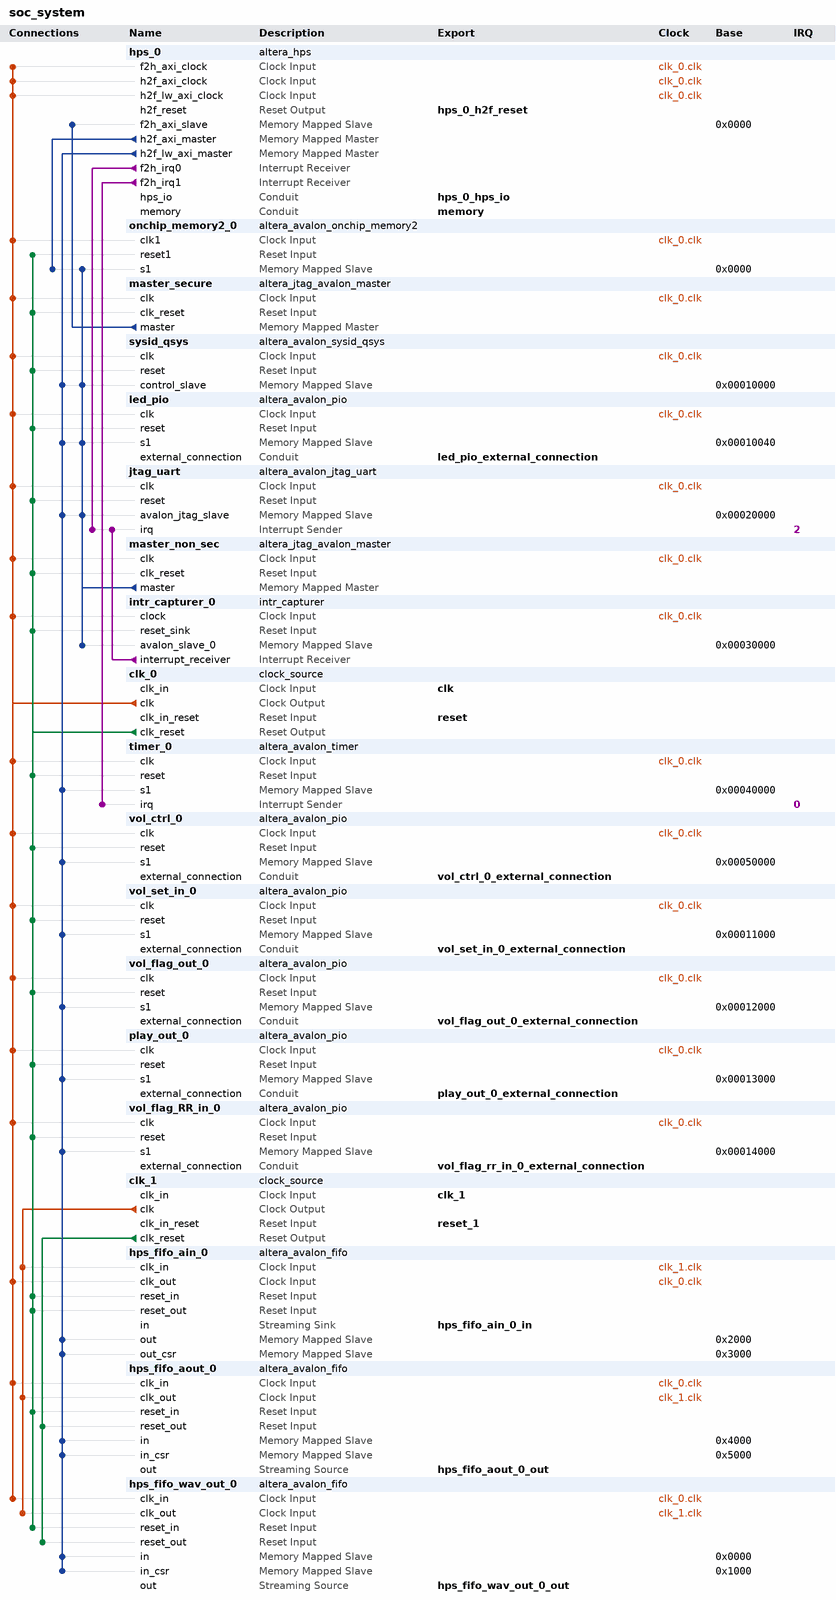
[diagram p0: system contents]
# Platform Designer (Qsys) system soc_system, Cyclone V 5CSEMA5F31C6
# Parameters at their usual value, and those the tool derives, are not listed.
package require -exact qsys 15.1
create_system soc_system
set_project_property DEVICE_FAMILY {Cyclone V}
set_project_property DEVICE 5CSEMA5F31C6

add_instance hps_0 altera_hps 15.1
set_instance_parameter_value hps_0 EMAC1_Mode RGMII
set_instance_parameter_value hps_0 EMAC1_PinMuxing {HPS I/O Set 0}
set_instance_parameter_value hps_0 F2SCLK_COLDRST_Enable false
set_instance_parameter_value hps_0 F2SCLK_DBGRST_Enable false
set_instance_parameter_value hps_0 F2SCLK_WARMRST_Enable false
set_instance_parameter_value hps_0 F2SINTERRUPT_Enable true
set_instance_parameter_value hps_0 F2S_Width 2
set_instance_parameter_value hps_0 FPGA_PERIPHERAL_OUTPUT_CLOCK_FREQ_EMAC0_GTX_CLK 100
set_instance_parameter_value hps_0 FPGA_PERIPHERAL_OUTPUT_CLOCK_FREQ_EMAC0_MD_CLK 100.0
set_instance_parameter_value hps_0 FPGA_PERIPHERAL_OUTPUT_CLOCK_FREQ_EMAC1_GTX_CLK 100
set_instance_parameter_value hps_0 FPGA_PERIPHERAL_OUTPUT_CLOCK_FREQ_EMAC1_MD_CLK 100.0
set_instance_parameter_value hps_0 HPS_PROTOCOL DDR3
set_instance_parameter_value hps_0 I2C0_Mode I2C
set_instance_parameter_value hps_0 I2C0_PinMuxing {HPS I/O Set 0}
set_instance_parameter_value hps_0 I2C1_Mode I2C
set_instance_parameter_value hps_0 I2C1_PinMuxing {HPS I/O Set 0}
set_instance_parameter_value hps_0 LWH2F_Enable true
set_instance_parameter_value hps_0 MEM_BANKADDR_WIDTH 3
set_instance_parameter_value hps_0 MEM_CLK_FREQ 400.0
set_instance_parameter_value hps_0 MEM_COL_ADDR_WIDTH 10
set_instance_parameter_value hps_0 MEM_DQ_WIDTH 32
set_instance_parameter_value hps_0 MEM_DRV_STR RZQ/7
set_instance_parameter_value hps_0 MEM_ROW_ADDR_WIDTH 15
set_instance_parameter_value hps_0 MEM_RTT_NOM RZQ/4
set_instance_parameter_value hps_0 MEM_RTT_WR RZQ/4
set_instance_parameter_value hps_0 MEM_TCL 11
set_instance_parameter_value hps_0 MEM_TFAW_NS 30.0
set_instance_parameter_value hps_0 MEM_TRAS_NS 35.0
set_instance_parameter_value hps_0 MEM_TRCD_NS 13.75
set_instance_parameter_value hps_0 MEM_TRFC_NS 260.0
set_instance_parameter_value hps_0 MEM_TRP_NS 13.75
set_instance_parameter_value hps_0 MEM_VENDOR Micron
set_instance_parameter_value hps_0 MEM_WTCL 8
set_instance_parameter_value hps_0 QSPI_Mode {1 SS}
set_instance_parameter_value hps_0 QSPI_PinMuxing {HPS I/O Set 0}
set_instance_parameter_value hps_0 REF_CLK_FREQ 25.0
set_instance_parameter_value hps_0 S2FCLK_USER2CLK 1
set_instance_parameter_value hps_0 S2F_Width 3
set_instance_parameter_value hps_0 SDIO_Mode {4-bit Data}
set_instance_parameter_value hps_0 SDIO_PinMuxing {HPS I/O Set 0}
set_instance_parameter_value hps_0 SPIM1_Mode {Single Slave Select}
set_instance_parameter_value hps_0 SPIM1_PinMuxing {HPS I/O Set 0}
set_instance_parameter_value hps_0 STM_Enable false
set_instance_parameter_value hps_0 TIMING_BOARD_AC_SKEW 0.02
set_instance_parameter_value hps_0 TIMING_BOARD_AC_TO_CK_SKEW 0.01
set_instance_parameter_value hps_0 TIMING_BOARD_DQ_TO_DQS_SKEW 0.05
set_instance_parameter_value hps_0 TIMING_BOARD_MAX_CK_DELAY 0.03
set_instance_parameter_value hps_0 TIMING_BOARD_MAX_DQS_DELAY 0.02
set_instance_parameter_value hps_0 TIMING_BOARD_SKEW_BETWEEN_DQS 0.06
set_instance_parameter_value hps_0 TIMING_BOARD_SKEW_CKDQS_DIMM_MAX 0.12
set_instance_parameter_value hps_0 TIMING_BOARD_SKEW_CKDQS_DIMM_MIN 0.06
set_instance_parameter_value hps_0 TIMING_BOARD_SKEW_WITHIN_DQS 0.01
set_instance_parameter_value hps_0 TIMING_TDH 65
set_instance_parameter_value hps_0 TIMING_TDQSCK 255
set_instance_parameter_value hps_0 TIMING_TDQSQ 125
set_instance_parameter_value hps_0 TIMING_TDS 30
set_instance_parameter_value hps_0 TIMING_TIH 140
set_instance_parameter_value hps_0 TIMING_TIS 180
set_instance_parameter_value hps_0 TIMING_TQSH 0.4
set_instance_parameter_value hps_0 UART0_Mode {No Flow Control}
set_instance_parameter_value hps_0 UART0_PinMuxing {HPS I/O Set 0}
set_instance_parameter_value hps_0 USB1_Mode SDR
set_instance_parameter_value hps_0 USB1_PinMuxing {HPS I/O Set 0}
set_instance_parameter_value hps_0 desired_cfg_clk_mhz 100.0
set_instance_parameter_value hps_0 desired_qspi_clk_mhz 400.0

add_instance onchip_memory2_0 altera_avalon_onchip_memory2 15.1
set_instance_parameter_value onchip_memory2_0 dataWidth 64
set_instance_parameter_value onchip_memory2_0 dualPort false
set_instance_parameter_value onchip_memory2_0 initMemContent true
set_instance_parameter_value onchip_memory2_0 initializationFileName onchip_memory2_0
set_instance_parameter_value onchip_memory2_0 memorySize 65536

add_instance master_secure altera_jtag_avalon_master 15.1

add_instance sysid_qsys altera_avalon_sysid_qsys 15.1
set_instance_parameter_value sysid_qsys id -1395322110

add_instance led_pio altera_avalon_pio 15.1
set_instance_parameter_value led_pio direction Output
set_instance_parameter_value led_pio resetValue 15
set_instance_parameter_value led_pio width 10

add_instance jtag_uart altera_avalon_jtag_uart 15.1
set_instance_parameter_value jtag_uart allowMultipleConnections true
set_instance_parameter_value jtag_uart simInteractiveOptions INTERACTIVE_ASCII_OUTPUT

add_instance master_non_sec altera_jtag_avalon_master 15.1

add_instance intr_capturer_0 intr_capturer 100.99.98.97

add_instance clk_0 clock_source 15.1
set_instance_parameter_value clk_0 clockFrequency 50000000

add_instance timer_0 altera_avalon_timer 15.1
set_instance_parameter_value timer_0 period 1
set_instance_parameter_value timer_0 periodUnits MSEC

add_instance vol_ctrl_0 altera_avalon_pio 15.1
set_instance_parameter_value vol_ctrl_0 direction Output
set_instance_parameter_value vol_ctrl_0 resetValue 121
set_instance_parameter_value vol_ctrl_0 width 7

add_instance vol_set_in_0 altera_avalon_pio 15.1
set_instance_parameter_value vol_set_in_0 direction Input
set_instance_parameter_value vol_set_in_0 width 1

add_instance vol_flag_out_0 altera_avalon_pio 15.1
set_instance_parameter_value vol_flag_out_0 direction Output
set_instance_parameter_value vol_flag_out_0 width 1

add_instance play_out_0 altera_avalon_pio 15.1
set_instance_parameter_value play_out_0 direction Output
set_instance_parameter_value play_out_0 width 1

add_instance vol_flag_RR_in_0 altera_avalon_pio 15.1
set_instance_parameter_value vol_flag_RR_in_0 direction Input
set_instance_parameter_value vol_flag_RR_in_0 width 1

add_instance clk_1 clock_source 15.1
set_instance_parameter_value clk_1 clockFrequency 18432000
set_instance_parameter_value clk_1 clockFrequencyKnown false

add_instance hps_fifo_ain_0 altera_avalon_fifo 15.1
set_instance_parameter_value hps_fifo_ain_0 bitsPerSymbol 32
set_instance_parameter_value hps_fifo_ain_0 channelWidth 0
set_instance_parameter_value hps_fifo_ain_0 errorWidth 0
set_instance_parameter_value hps_fifo_ain_0 fifoDepth 2048
set_instance_parameter_value hps_fifo_ain_0 fifoInputInterfaceOptions AVALONST_SINK
set_instance_parameter_value hps_fifo_ain_0 fifoOutputInterfaceOptions AVALONMM_READ
set_instance_parameter_value hps_fifo_ain_0 singleClockMode false
set_instance_parameter_value hps_fifo_ain_0 symbolsPerBeat 1
set_instance_parameter_value hps_fifo_ain_0 useIRQ false
set_instance_parameter_value hps_fifo_ain_0 usePacket false
set_instance_parameter_value hps_fifo_ain_0 useReadControl true
set_instance_parameter_value hps_fifo_ain_0 useWriteControl false

add_instance hps_fifo_aout_0 altera_avalon_fifo 15.1
set_instance_parameter_value hps_fifo_aout_0 bitsPerSymbol 32
set_instance_parameter_value hps_fifo_aout_0 channelWidth 0
set_instance_parameter_value hps_fifo_aout_0 errorWidth 0
set_instance_parameter_value hps_fifo_aout_0 fifoDepth 2048
set_instance_parameter_value hps_fifo_aout_0 fifoInputInterfaceOptions AVALONMM_WRITE
set_instance_parameter_value hps_fifo_aout_0 fifoOutputInterfaceOptions AVALONST_SOURCE
set_instance_parameter_value hps_fifo_aout_0 singleClockMode false
set_instance_parameter_value hps_fifo_aout_0 symbolsPerBeat 1
set_instance_parameter_value hps_fifo_aout_0 useIRQ false
set_instance_parameter_value hps_fifo_aout_0 usePacket false
set_instance_parameter_value hps_fifo_aout_0 useReadControl false

add_instance hps_fifo_wav_out_0 altera_avalon_fifo 15.1
set_instance_parameter_value hps_fifo_wav_out_0 bitsPerSymbol 32
set_instance_parameter_value hps_fifo_wav_out_0 channelWidth 0
set_instance_parameter_value hps_fifo_wav_out_0 errorWidth 0
set_instance_parameter_value hps_fifo_wav_out_0 fifoDepth 2048
set_instance_parameter_value hps_fifo_wav_out_0 fifoInputInterfaceOptions AVALONMM_WRITE
set_instance_parameter_value hps_fifo_wav_out_0 fifoOutputInterfaceOptions AVALONST_SOURCE
set_instance_parameter_value hps_fifo_wav_out_0 singleClockMode false
set_instance_parameter_value hps_fifo_wav_out_0 symbolsPerBeat 1
set_instance_parameter_value hps_fifo_wav_out_0 useIRQ false
set_instance_parameter_value hps_fifo_wav_out_0 usePacket false
set_instance_parameter_value hps_fifo_wav_out_0 useReadControl false

# connections
add_connection clk_0.clk hps_0.f2h_axi_clock clock
add_connection clk_0.clk hps_0.h2f_axi_clock clock
add_connection clk_0.clk hps_0.h2f_lw_axi_clock clock
add_connection clk_0.clk hps_fifo_ain_0.clk_out clock
add_connection clk_0.clk hps_fifo_aout_0.clk_in clock
add_connection clk_0.clk hps_fifo_wav_out_0.clk_in clock
add_connection clk_0.clk intr_capturer_0.clock clock
add_connection clk_0.clk jtag_uart.clk clock
add_connection clk_0.clk led_pio.clk clock
add_connection clk_0.clk master_non_sec.clk clock
add_connection clk_0.clk master_secure.clk clock
add_connection clk_0.clk onchip_memory2_0.clk1 clock
add_connection clk_0.clk play_out_0.clk clock
add_connection clk_0.clk sysid_qsys.clk clock
add_connection clk_0.clk timer_0.clk clock
add_connection clk_0.clk vol_ctrl_0.clk clock
add_connection clk_0.clk vol_flag_out_0.clk clock
add_connection clk_0.clk vol_flag_RR_in_0.clk clock
add_connection clk_0.clk vol_set_in_0.clk clock
add_connection clk_1.clk hps_fifo_ain_0.clk_in clock
add_connection clk_1.clk hps_fifo_aout_0.clk_out clock
add_connection clk_1.clk hps_fifo_wav_out_0.clk_out clock
add_connection clk_0.clk_reset hps_fifo_ain_0.reset_in reset
add_connection clk_0.clk_reset hps_fifo_ain_0.reset_out reset
add_connection clk_0.clk_reset hps_fifo_aout_0.reset_in reset
add_connection clk_0.clk_reset hps_fifo_wav_out_0.reset_in reset
add_connection clk_0.clk_reset intr_capturer_0.reset_sink reset
add_connection clk_0.clk_reset jtag_uart.reset reset
add_connection clk_0.clk_reset led_pio.reset reset
add_connection clk_0.clk_reset master_non_sec.clk_reset reset
add_connection clk_0.clk_reset master_secure.clk_reset reset
add_connection clk_0.clk_reset onchip_memory2_0.reset1 reset
add_connection clk_0.clk_reset play_out_0.reset reset
add_connection clk_0.clk_reset sysid_qsys.reset reset
add_connection clk_0.clk_reset timer_0.reset reset
add_connection clk_0.clk_reset vol_ctrl_0.reset reset
add_connection clk_0.clk_reset vol_flag_out_0.reset reset
add_connection clk_0.clk_reset vol_flag_RR_in_0.reset reset
add_connection clk_0.clk_reset vol_set_in_0.reset reset
add_connection clk_1.clk_reset hps_fifo_aout_0.reset_out reset
add_connection clk_1.clk_reset hps_fifo_wav_out_0.reset_out reset
add_connection hps_0.h2f_axi_master onchip_memory2_0.s1 avalon
set_connection_parameter_value hps_0.h2f_axi_master/onchip_memory2_0.s1 baseAddress 0x0000
add_connection hps_0.h2f_lw_axi_master hps_fifo_ain_0.out avalon
set_connection_parameter_value hps_0.h2f_lw_axi_master/hps_fifo_ain_0.out baseAddress 0x2000
add_connection hps_0.h2f_lw_axi_master hps_fifo_ain_0.out_csr avalon
set_connection_parameter_value hps_0.h2f_lw_axi_master/hps_fifo_ain_0.out_csr baseAddress 0x3000
add_connection hps_0.h2f_lw_axi_master hps_fifo_aout_0.in avalon
set_connection_parameter_value hps_0.h2f_lw_axi_master/hps_fifo_aout_0.in baseAddress 0x4000
add_connection hps_0.h2f_lw_axi_master hps_fifo_aout_0.in_csr avalon
set_connection_parameter_value hps_0.h2f_lw_axi_master/hps_fifo_aout_0.in_csr baseAddress 0x5000
add_connection hps_0.h2f_lw_axi_master hps_fifo_wav_out_0.in avalon
set_connection_parameter_value hps_0.h2f_lw_axi_master/hps_fifo_wav_out_0.in baseAddress 0x0000
add_connection hps_0.h2f_lw_axi_master hps_fifo_wav_out_0.in_csr avalon
set_connection_parameter_value hps_0.h2f_lw_axi_master/hps_fifo_wav_out_0.in_csr baseAddress 0x1000
add_connection hps_0.h2f_lw_axi_master jtag_uart.avalon_jtag_slave avalon
set_connection_parameter_value hps_0.h2f_lw_axi_master/jtag_uart.avalon_jtag_slave baseAddress 0x00020000
add_connection hps_0.h2f_lw_axi_master led_pio.s1 avalon
set_connection_parameter_value hps_0.h2f_lw_axi_master/led_pio.s1 baseAddress 0x00010040
add_connection hps_0.h2f_lw_axi_master play_out_0.s1 avalon
set_connection_parameter_value hps_0.h2f_lw_axi_master/play_out_0.s1 baseAddress 0x00013000
add_connection hps_0.h2f_lw_axi_master sysid_qsys.control_slave avalon
set_connection_parameter_value hps_0.h2f_lw_axi_master/sysid_qsys.control_slave baseAddress 0x00010000
add_connection hps_0.h2f_lw_axi_master timer_0.s1 avalon
set_connection_parameter_value hps_0.h2f_lw_axi_master/timer_0.s1 baseAddress 0x00040000
add_connection hps_0.h2f_lw_axi_master vol_ctrl_0.s1 avalon
set_connection_parameter_value hps_0.h2f_lw_axi_master/vol_ctrl_0.s1 baseAddress 0x00050000
add_connection hps_0.h2f_lw_axi_master vol_flag_out_0.s1 avalon
set_connection_parameter_value hps_0.h2f_lw_axi_master/vol_flag_out_0.s1 baseAddress 0x00012000
add_connection hps_0.h2f_lw_axi_master vol_flag_RR_in_0.s1 avalon
set_connection_parameter_value hps_0.h2f_lw_axi_master/vol_flag_RR_in_0.s1 baseAddress 0x00014000
add_connection hps_0.h2f_lw_axi_master vol_set_in_0.s1 avalon
set_connection_parameter_value hps_0.h2f_lw_axi_master/vol_set_in_0.s1 baseAddress 0x00011000
add_connection master_non_sec.master intr_capturer_0.avalon_slave_0 avalon
set_connection_parameter_value master_non_sec.master/intr_capturer_0.avalon_slave_0 baseAddress 0x00030000
add_connection master_non_sec.master jtag_uart.avalon_jtag_slave avalon
set_connection_parameter_value master_non_sec.master/jtag_uart.avalon_jtag_slave baseAddress 0x00020000
add_connection master_non_sec.master led_pio.s1 avalon
set_connection_parameter_value master_non_sec.master/led_pio.s1 baseAddress 0x00010040
add_connection master_non_sec.master onchip_memory2_0.s1 avalon
set_connection_parameter_value master_non_sec.master/onchip_memory2_0.s1 baseAddress 0x0000
add_connection master_non_sec.master sysid_qsys.control_slave avalon
set_connection_parameter_value master_non_sec.master/sysid_qsys.control_slave baseAddress 0x00010000
add_connection master_secure.master hps_0.f2h_axi_slave avalon
set_connection_parameter_value master_secure.master/hps_0.f2h_axi_slave baseAddress 0x0000
add_connection hps_0.f2h_irq0 jtag_uart.irq interrupt
set_connection_parameter_value hps_0.f2h_irq0/jtag_uart.irq irqNumber 2
add_connection hps_0.f2h_irq1 timer_0.irq interrupt
set_connection_parameter_value hps_0.f2h_irq1/timer_0.irq irqNumber 0
add_connection intr_capturer_0.interrupt_receiver jtag_uart.irq interrupt
set_connection_parameter_value intr_capturer_0.interrupt_receiver/jtag_uart.irq irqNumber 2

# exported interfaces
add_interface clk clock sink
set_interface_property clk EXPORT_OF clk_0.clk_in
add_interface clk_1 clock sink
set_interface_property clk_1 EXPORT_OF clk_1.clk_in
add_interface hps_0_h2f_reset reset source
set_interface_property hps_0_h2f_reset EXPORT_OF hps_0.h2f_reset
add_interface hps_0_hps_io conduit end
set_interface_property hps_0_hps_io EXPORT_OF hps_0.hps_io
add_interface hps_fifo_ain_0_in avalon_streaming sink
set_interface_property hps_fifo_ain_0_in EXPORT_OF hps_fifo_ain_0.in
add_interface hps_fifo_aout_0_out avalon_streaming source
set_interface_property hps_fifo_aout_0_out EXPORT_OF hps_fifo_aout_0.out
add_interface hps_fifo_wav_out_0_out avalon_streaming source
set_interface_property hps_fifo_wav_out_0_out EXPORT_OF hps_fifo_wav_out_0.out
add_interface led_pio_external_connection conduit end
set_interface_property led_pio_external_connection EXPORT_OF led_pio.external_connection
add_interface memory conduit end
set_interface_property memory EXPORT_OF hps_0.memory
add_interface play_out_0_external_connection conduit end
set_interface_property play_out_0_external_connection EXPORT_OF play_out_0.external_connection
add_interface reset reset sink
set_interface_property reset EXPORT_OF clk_0.clk_in_reset
add_interface reset_1 reset sink
set_interface_property reset_1 EXPORT_OF clk_1.clk_in_reset
add_interface vol_ctrl_0_external_connection conduit end
set_interface_property vol_ctrl_0_external_connection EXPORT_OF vol_ctrl_0.external_connection
add_interface vol_flag_out_0_external_connection conduit end
set_interface_property vol_flag_out_0_external_connection EXPORT_OF vol_flag_out_0.external_connection
add_interface vol_flag_rr_in_0_external_connection conduit end
set_interface_property vol_flag_rr_in_0_external_connection EXPORT_OF vol_flag_RR_in_0.external_connection
add_interface vol_set_in_0_external_connection conduit end
set_interface_property vol_set_in_0_external_connection EXPORT_OF vol_set_in_0.external_connection

set_interconnect_requirement {$system} qsys_mm.clockCrossingAdapter HANDSHAKE
set_interconnect_requirement {$system} qsys_mm.maxAdditionalLatency 1

save_system soc_system.qsys
